# Altium schematic sheet [3] LORA MODULE.SchDoc: LLCC68 LoRa IC
size A3; CompanyName: RADWAG Wagi Elektroniczne; Organization: RADWAG Wagi Elektroniczne; Address1: ul. Bracka 28; Address2: 26-600 RADOM; Address3: POLAND; SheetNumber: 3; SheetTotal: 6
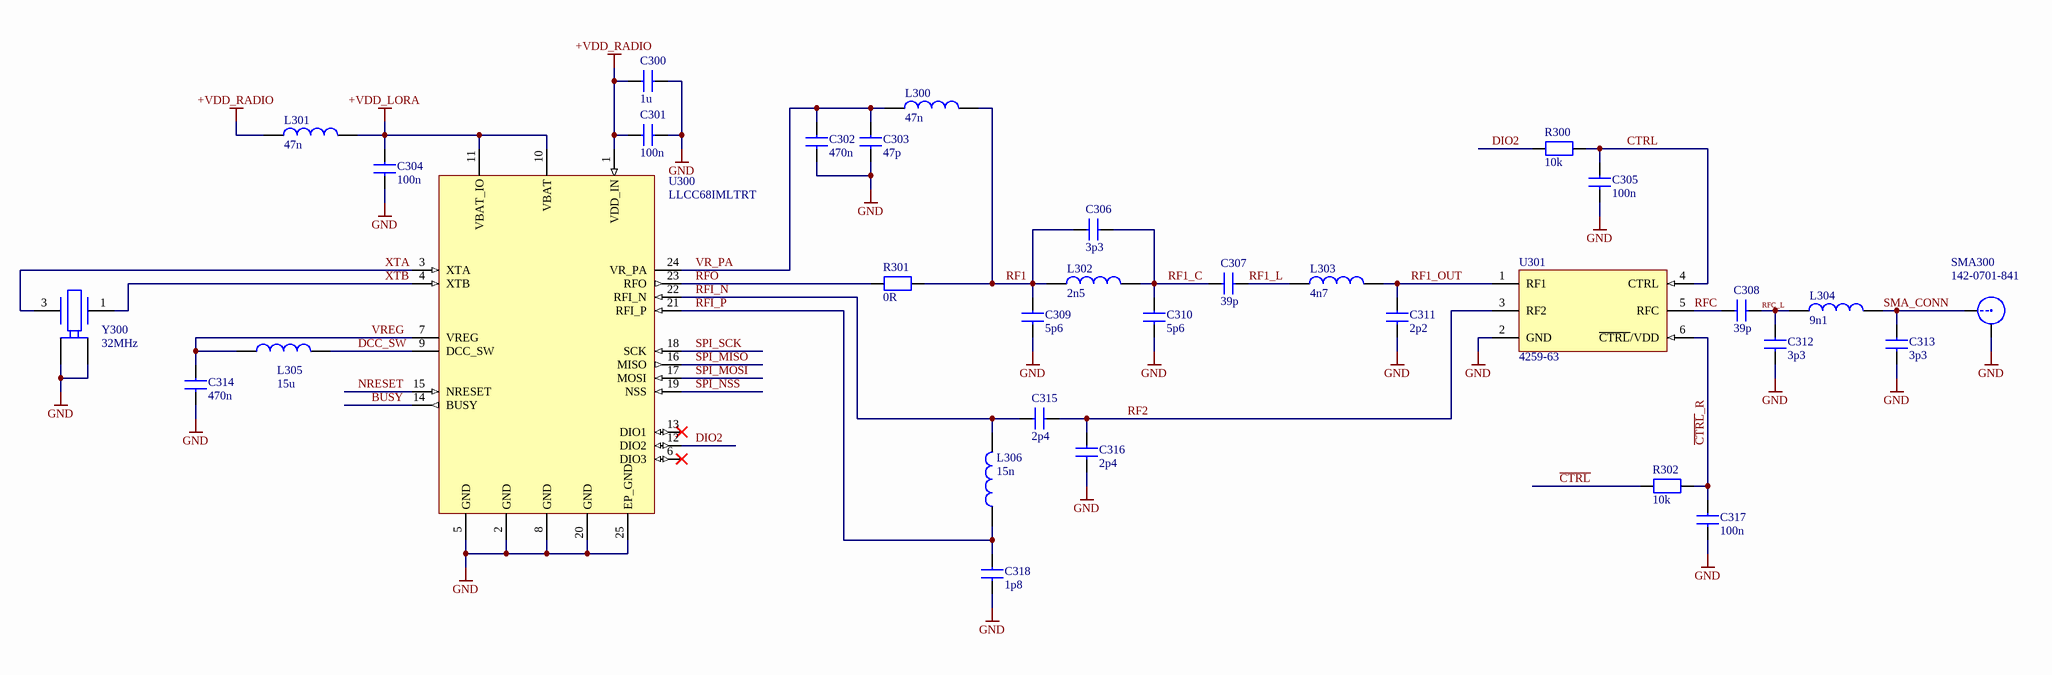
[diagram p0: [3] LORA MODULE.SchDoc]

## Parts
C300  1u  [C0402]
C301  100n  [C0402]
C302  470n  [C0402]
C303  47p  [C0402]
C304  100n  [C0402]
C305  100n  [C0402]
C306  3p3  [C0402]
C307  39p  [C0402]
C308  39p  [C0402]
C309  5p6  [C0402]
C310  5p6  [C0402]
C311  2p2  [C0402]
C312  3p3  [C0402]
C313  3p3  [C0402]
C314  470n  [C0402]
C315  2p4  [C0402]
C316  2p4  [C0402]
C317  100n  [C0402]
C318  1p8  [C0402]
L300  47n  [L0402]
L301  47n  [L0402]
L302  2n5  [l0402]
L303  4n7  [L0402]
L304  9n1  [L0402]
L305  15u  [L0805]
L306  15n  [L0402]
R300  10k  [R0402]
R301  0R  [R0402]
R302  10k  [R0402]
SMA300  142-0701-841  [SMA_STRAIGHT_CONN]
U300  LLCC68IMLTRT  [QFN24]
U301  4259-63  [SC70]
Y300  32MHz  [OSCILATOR_5X3_2]

## Nets
+VDD_LORA: C304.1 L301.2 U300.10(VBAT) U300.11(VBAT_IO)
+VDD_RADIO: C300.2 C301.2 L301.1 U300.1(VDD_IN)
GND: C300.1 C301.1 C302.1 C303.1 C304.2 C305.2 C309.1 C310.1 C311.1 C312.2 C313.2 C314.1 C316.2 C317.2 C318.1 SMA300.2 U300.2(GND) U300.5(GND) U300.8(GND) U300.20(GND) U300.25(EP_GND) U301.2(GND) Y300.2 Y300.4
~{CTRL}: R302.1
~{CTRL}_R: C317.1 R302.2 U301.6(~{CTRL}/VDD)
BUSY: U300.14(BUSY)
CTRL: C305.1 R300.2 U301.4(CTRL)
DCC_SW: L305.2 U300.9(DCC_SW)
DIO2: R300.1 U300.12(DIO2)
NRESET: U300.15(NRESET)
RF1: C306.2 C309.2 L300.2 L302.1 R301.2
RF1_C: C306.1 C307.2 C310.2 L302.2
RF1_L: C307.1 L303.1
RF1_OUT: C311.2 L303.2 U301.1(RF1)
RF2: C315.1 C316.1 U301.3(RF2)
RFC: C308.2 U301.5(RFC)
RFC_L: C308.1 C312.1 L304.1
RFI_N: C315.2 L306.2 U300.22(RFI_N)
RFI_P: C318.2 L306.1 U300.21(RFI_P)
RFO: R301.1 U300.23(RFO)
SMA_CONN: C313.1 L304.2 SMA300.1
SPI_MISO: U300.16(MISO)
SPI_MOSI: U300.17(MOSI)
SPI_NSS: U300.19(NSS)
SPI_SCK: U300.18(SCK)
VR_PA: C302.2 C303.2 L300.1 U300.24(VR_PA)
VREG: C314.2 L305.1 U300.7(VREG)
XTA: U300.3(XTA) Y300.3
XTB: U300.4(XTB) Y300.1

Not connected (* = marked no-connect by the designer): U300 6(DIO3)* 13(DIO1)*

## Notes on the sheet
- Title:
- Size: A3
- Page contents:
- Date:
- Version:
- Drawn by:
- Issue:
- Sheet number:
- of

## Library data of the parts
C300 = 0402X105K100CT: Multilayer Ceramic Capacitor, 1 uF, 10%, X5r, 10 V, 0402 [1005 Metric]; Manufacturer: Walsin Technologies; Supplier: Arrow Electronics; Supplier Part Number: 0402X105K100CT; Manufacturer Part Number: 0402X105K100CT; RoHS: Yes; Category: Ceramic Capacitors; Stock: 760000; Pricing: 10000=0,0037, 20000=0,0027, 50000=0,0026, 100000=0,0025, 250000=0,0023 (USD); ComponentLink1URL: http://www.farnell.com/datasheets/2340522.pdf?src-supplier=Farnell; ComponentLink1Description: http://www.farnell.com/datasheets/2340522.pdf?src-supplier=Farnell; ComponentLink2URL: http://www.farnell.com/datasheets/1958513.pdf?src-supplier=Farnell; ComponentLink2Description: http://www.farnell.com/datasheets/1958513.pdf?src-supplier=Farnell; ComponentLink3URL: http://www.farnell.com/datasheets/1958513.pdf?src-supplier=Element14; ComponentLink3Description: http://www.farnell.com/datasheets/1958513.pdf?src-supplier=Element14; ComponentLink4URL: https://datasheet.octopart.com/0402X105K100CT-Walsin-Technologies-datasheet-128065749.pdf?src-supplier=Future+Electronics; ComponentLink4Description: https://datasheet.octopart.com/0402X105K100CT-Walsin-Technologies-datasheet-128065749.pdf?src-supplier=Future+Electronics; ComponentLink5URL: https://datasheet.octopart.com/0402X105K100CT-Walsin-Technologies-datasheet-62066062.pdf?src-supplier=TME; ComponentLink5Description: https://datasheet.octopart.com/0402X105K100CT-Walsin-Technologies-datasheet-62066062.pdf?src-supplier=TME; ComponentLink6URL: https://datasheet.octopart.com/0402X105K100CT-Walsin-Technologies-datasheet-136037192.pdf?src-supplier=TECHDesign; ComponentLink6Description: https://datasheet.octopart.com/0402X105K100CT-Walsin-Technologies-datasheet-136037192.pdf?src-supplier=TECHDesign
C301 C304 C305 C317 = 04023C104KAT2A: Multilayer Ceramic Capacitor, 0.1 uF, 25 V, ± 10%, X7R, 0402 [1005 Metric]; Manufacturer: Kyocera AVX; Material: 4241ConductorMaterial; Value: 100nF; Voltage Rating: 25V; Supplier: Arrow Electronics; Supplier Part Number: 04023C104KAT2A; Manufacturer Part Number: 04023C104KAT2A; RoHS: Yes; Category: Ceramic Capacitors; Stock: 5700000; Pricing: 10000=0,0064, 20000=0,0061, 30000=0,0058, 50000=0,0052, 100000=0,0042, 150000=0,0038 (USD); Mounting Technology: Surface Mount; Case/Package: 0402; Pins: 2; Case Code (Metric): 1005; Case Code (Imperial): 0402; Min Operating Temperature: -55°C; Max Operating Temperature: 125°C; Tolerance: 10%; Dielectric: X7R; Packaging: Cut Tape; Voltage Rating (DC): 25V; Voltage: 25V; Series: -; Width: 1mm; Reach SVHC Compliant: No; Lead Free: Lead Free; RoHS Compliant: Yes; ComponentLink1URL: https://datasheet.ciiva.com/6265/cx7r-6265272.pdf?src-supplier=Digi-Key; ComponentLink1Description: https://datasheet.ciiva.com/6265/cx7r-6265272.pdf?src-supplier=Digi-Key; ComponentLink2URL: https://datasheet.ciiva.com/1123/1679506-1123344.pdf?src-supplier=Element14; ComponentLink2Description: https://datasheet.ciiva.com/1123/1679506-1123344.pdf?src-supplier=Element14; ComponentLink3URL: https://datasheet.ciiva.com/7709/1679506-7709527.pdf?src-supplier=Element14; ComponentLink3Description: https://datasheet.ciiva.com/7709/1679506-7709527.pdf?src-supplier=Element14; ComponentLink4URL: https://datasheet.ciiva.com/14906/cx7r-14906223.pdf?src-supplier=Digi-Key; ComponentLink4Description: https://datasheet.ciiva.com/14906/cx7r-14906223.pdf?src-supplier=Digi-Key; ComponentLink5URL: https://datasheet.ciiva.com/7614/cx7r-7614663.pdf?src-supplier=Digi-Key; ComponentLink5Description: https://datasheet.ciiva.com/7614/cx7r-7614663.pdf?src-supplier=Digi-Key
C302 C314 = GRM155R61A474ME15D: 0402 0.47 uF 10 V ±20% Tolerance X5R SMT Multilayer Ceramic Capacitor; Manufacturer: Murata; Supplier: Arrow Electronics; Supplier Part Number: GRM155R61A474ME15D; Manufacturer Part Number: GRM155R61A474ME15D; RoHS: Yes; Category: Ceramic Capacitors; Stock: 1003; Pricing: 1=0,0582, 10=0,0427, 25=0,0424, 100=0,0255, 250=0,0253, 500=0,025, 1000=0,0141 (USD); ComponentLink1URL: http://www.mouser.com/ds/2/281/c02e-2905.pdf?src-supplier=Mouser; ComponentLink1Description: http://www.mouser.com/ds/2/281/c02e-2905.pdf?src-supplier=Mouser; ComponentLink2URL: https://search.murata.co.jp/Ceramy/image/img/A01X/G101/ENG/GRM155R61A474ME15-01.pdf?src-supplier=Digi-Key; ComponentLink2Description: https://search.murata.co.jp/Ceramy/image/img/A01X/G101/ENG/GRM155R61A474ME15-01.pdf?src-supplier=Digi-Key
C303 = GRM1555C1H470JA01D: 0402 47 pF 50 V ±5% Tolerance C0G SMT Multilayer Ceramic Capacitor; Manufacturer: Murata; Value: 47pF; Voltage Rating: 50V; Supplier: Arrow Electronics; Supplier Part Number: GRM1555C1H470JA01D; Manufacturer Part Number: GRM1555C1H470JA01D; RoHS: Yes; Category: Ceramic Capacitors; Stock: 70000; Pricing: 10000=0,004 (USD); Mounting Technology: Surface Mount; Case/Package: 0402; Case Code (Metric): 1005; Case Code (Imperial): 0402; Material: Ceramic; Min Operating Temperature: -55°C; Max Operating Temperature: 125°C; Packaging: Tape and Reel; Package Quantity: 1; Voltage Rating (DC): 50V; Dielectric: C0G; Termination: SMD/SMT; Voltage: 50V; Series: GRM; Construction: Flat; Tolerance: 5%; Length: 1mm; Width: 0.02inch; Height: 0.5mm; Thickness: 0.022inch; Depth: 0.5mm; Radiation Hardening: No; Reach SVHC Compliant: No; Lead Free: Lead Free; RoHS Compliant: Yes; ComponentLink1URL: https://datasheet.ciiva.com/6271/grm1555c1h470ja01-01-6271072.pdf?src-supplier=Digi-Key; ComponentLink1Description: https://datasheet.ciiva.com/6271/grm1555c1h470ja01-01-6271072.pdf?src-supplier=Digi-Key; ComponentLink2URL: https://datasheet.ciiva.com/18184/getdatasheetpartid-301776-18184389.pdf?src-supplier=Verical; ComponentLink2Description: https://datasheet.ciiva.com/18184/getdatasheetpartid-301776-18184389.pdf?src-supplier=Verical; ComponentLink3URL: https://datasheet.ciiva.com/29199/453886-da-01-en-vs-kondensator-0402-29199975.pdf?src-supplier=Conrad; ComponentLink3Description: https://datasheet.ciiva.com/29199/453886-da-01-en-vs-kondensator-0402-29199975.pdf?src-supplier=Conrad; ComponentLink4URL: https://datasheet.ciiva.com/6271/partnumbering-e-01-6271070.pdf?src-supplier=Digi-Key; ComponentLink4Description: https://datasheet.ciiva.com/6271/partnumbering-e-01-6271070.pdf?src-supplier=Digi-Key; ComponentLink5URL: https://datasheet.ciiva.com/6271/partnumbering-e-01-6271077.pdf?src-supplier=Digi-Key; ComponentLink5Description: https://datasheet.ciiva.com/6271/partnumbering-e-01-6271077.pdf?src-supplier=Digi-Key; ComponentLink6URL: https://datasheet.ciiva.com/2989/product-2989327.pdf?src-supplier=Avnet; ComponentLink6Description: https://datasheet.ciiva.com/2989/product-2989327.pdf?src-supplier=Avnet; ComponentLink7URL: https://datasheet.ciiva.com/16390/product-16390970.pdf?src-supplier=Future+Electronics; ComponentLink7Description: https://datasheet.ciiva.com/16390/product-16390970.pdf?src-supplier=Future+Electronics; ComponentLink8URL: https://datasheet.ciiva.com/48671/product-48671327.pdf?src-supplier=Avnet; ComponentLink8Description: https://datasheet.ciiva.com/48671/product-48671327.pdf?src-supplier=Avnet
C306 C312 C313 = GRM1555C1H3R3BA01D: 0402 3.3 pF 50 V ±0.1 pF Tolerance C0G SMT Multilayer Ceramic Capacitor; Manufacturer: Murata; Supplier: Arrow Electronics; Supplier Part Number: GRM1555C1H3R3BA01D; Manufacturer Part Number: GRM1555C1H3R3BA01D; RoHS: Yes; Category: Ceramic Capacitors; Stock: 38428; Pricing: 1=0,056, 10=0,0157, 25=0,0153, 100=0,0095, 250=0,0094, 500=0,0089, 1000=0,0084, 3000=0,0078, 6000=0,0073, 15000=0,0068, 30000=0,0063 (USD); ComponentLink1URL: https://datasheet.ciiva.com/6270/grm1555c1h3r0wa01-01-6270835.pdf?src-supplier=Digi-Key; ComponentLink1Description: https://datasheet.ciiva.com/6270/grm1555c1h3r0wa01-01-6270835.pdf?src-supplier=Digi-Key; ComponentLink2URL: https://datasheet.ciiva.com/18184/getdatasheetpartid-318269-18184366.pdf?src-supplier=Verical; ComponentLink2Description: https://datasheet.ciiva.com/18184/getdatasheetpartid-318269-18184366.pdf?src-supplier=Verical; ComponentLink3URL: https://datasheet.ciiva.com/11614/product-11614449.pdf?src-supplier=Avnet; ComponentLink3Description: https://datasheet.ciiva.com/11614/product-11614449.pdf?src-supplier=Avnet; ComponentLink4URL: https://datasheet.ciiva.com/3779/grm1555c1h3r3ba0123-3779149.pdf?src-supplier=Arrow+Electronics; ComponentLink4Description: https://datasheet.ciiva.com/3779/grm1555c1h3r3ba0123-3779149.pdf?src-supplier=Arrow+Electronics; ComponentLink5URL: https://datasheet.ciiva.com/6270/partnumbering-e-01-6270837.pdf?src-supplier=Digi-Key; ComponentLink5Description: https://datasheet.ciiva.com/6270/partnumbering-e-01-6270837.pdf?src-supplier=Digi-Key; ComponentLink6URL: https://datasheet.ciiva.com/6270/partnumbering-e-01-6270839.pdf?src-supplier=Digi-Key; ComponentLink6Description: https://datasheet.ciiva.com/6270/partnumbering-e-01-6270839.pdf?src-supplier=Digi-Key
C307 C308 = GRM1555C1H390JA01D: Multilayer Ceramic Capacitor, 39 pF, 50 V, ± 5%, C0G (NP0), 0402 [1005 Metric]; Manufacturer: Murata; Supplier: Arrow Electronics; Supplier Part Number: GRM1555C1H390JA01D; Manufacturer Part Number: GRM1555C1H390JA01D; RoHS: Yes; Category: Ceramic Capacitors; Stock: 480000; Pricing: 10000=0,0042, 20000=0,0041, 30000=0,004, 50000=0,0039 (USD); ComponentLink1URL: https://datasheet.ciiva.com/11787/0900766b80ef921d-11787646.pdf?src-supplier=Rs; ComponentLink1Description: https://datasheet.ciiva.com/11787/0900766b80ef921d-11787646.pdf?src-supplier=Rs; ComponentLink2URL: https://datasheet.ciiva.com/18184/getdatasheetpartid-387778-18184346.pdf?src-supplier=Verical; ComponentLink2Description: https://datasheet.ciiva.com/18184/getdatasheetpartid-387778-18184346.pdf?src-supplier=Verical; ComponentLink3URL: https://datasheet.ciiva.com/29199/453824-da-01-en-vs-kondensator-0402-29199954.pdf?src-supplier=Conrad; ComponentLink3Description: https://datasheet.ciiva.com/29199/453824-da-01-en-vs-kondensator-0402-29199954.pdf?src-supplier=Conrad; ComponentLink4URL: https://datasheet.ciiva.com/7828/608985-7828862.pdf?src-supplier=Element14; ComponentLink4Description: https://datasheet.ciiva.com/7828/608985-7828862.pdf?src-supplier=Element14; ComponentLink5URL: https://datasheet.ciiva.com/6277/partnumbering-e-01-6277829.pdf?src-supplier=Digi-Key; ComponentLink5Description: https://datasheet.ciiva.com/6277/partnumbering-e-01-6277829.pdf?src-supplier=Digi-Key; ComponentLink6URL: https://datasheet.ciiva.com/6277/partnumbering-e-01-6277830.pdf?src-supplier=Digi-Key; ComponentLink6Description: https://datasheet.ciiva.com/6277/partnumbering-e-01-6277830.pdf?src-supplier=Digi-Key; ComponentLink7URL: https://datasheet.ciiva.com/6256/partnumbering-e-01-6256393.pdf?src-supplier=Digi-Key; ComponentLink7Description: https://datasheet.ciiva.com/6256/partnumbering-e-01-6256393.pdf?src-supplier=Digi-Key
C309 C310 = GRM1555C1H5R6CA01D: Multilayer Ceramic Capacitor, 5.6 pF, 50 V, ± 0.25pF, C0G (NP0), 0402 [1005 Metric]; Manufacturer: Murata; Supplier: Arrow Electronics; Supplier Part Number: GRM1555C1H5R6CA01D; Manufacturer Part Number: GRM1555C1H5R6CA01D; RoHS: Yes; Category: Ceramic Capacitors; Stock: 119940; Pricing: 10000=0,005, 20000=0,0047, 30000=0,0046, 50000=0,0041, 100000=0,0038 (USD); ComponentLink1URL: https://datasheet.ciiva.com/11789/0900766b80ef921d-11789216.pdf?src-supplier=Rs; ComponentLink1Description: https://datasheet.ciiva.com/11789/0900766b80ef921d-11789216.pdf?src-supplier=Rs; ComponentLink2URL: https://datasheet.ciiva.com/18184/getdatasheetpartid-387782-18184441.pdf?src-supplier=Verical; ComponentLink2Description: https://datasheet.ciiva.com/18184/getdatasheetpartid-387782-18184441.pdf?src-supplier=Verical; ComponentLink3URL: https://datasheet.ciiva.com/6263/grm1555c1h5r6ca01-01-6263746.pdf?src-supplier=Digi-Key; ComponentLink3Description: https://datasheet.ciiva.com/6263/grm1555c1h5r6ca01-01-6263746.pdf?src-supplier=Digi-Key; ComponentLink4URL: https://datasheet.ciiva.com/7828/608985-7828876.pdf?src-supplier=Element14; ComponentLink4Description: https://datasheet.ciiva.com/7828/608985-7828876.pdf?src-supplier=Element14; ComponentLink5URL: https://datasheet.ciiva.com/11612/product-11612261.pdf?src-supplier=Avnet; ComponentLink5Description: https://datasheet.ciiva.com/11612/product-11612261.pdf?src-supplier=Avnet
C311 = GRM1555C1H2R2BA01D: CAP CER 2.2PF 50V C0G/NP0 0402; Manufacturer: Murata; Supplier: Arrow Electronics; Supplier Part Number: GRM1555C1H2R2BA01D; Manufacturer Part Number: GRM1555C1H2R2BA01D; RoHS: Yes; Category: Ceramic Capacitors; Stock: 68227; Pricing: 10000=0,0061 (USD); ComponentLink1URL: https://datasheet.ciiva.com/18184/getdatasheetpartid-316203-18184296.pdf?src-supplier=Verical; ComponentLink1Description: https://datasheet.ciiva.com/18184/getdatasheetpartid-316203-18184296.pdf?src-supplier=Verical; ComponentLink2URL: https://datasheet.ciiva.com/6270/grm1555c1h2r1wa01-01-6270869.pdf?src-supplier=Digi-Key; ComponentLink2Description: https://datasheet.ciiva.com/6270/grm1555c1h2r1wa01-01-6270869.pdf?src-supplier=Digi-Key; ComponentLink3URL: https://datasheet.ciiva.com/16440/c02e-16440539.pdf?src-supplier=Future+Electronics; ComponentLink3Description: https://datasheet.ciiva.com/16440/c02e-16440539.pdf?src-supplier=Future+Electronics; ComponentLink4URL: https://datasheet.ciiva.com/6270/partnumbering-e-01-6270873.pdf?src-supplier=Digi-Key; ComponentLink4Description: https://datasheet.ciiva.com/6270/partnumbering-e-01-6270873.pdf?src-supplier=Digi-Key; ComponentLink5URL: https://datasheet.ciiva.com/6270/partnumbering-e-01-6270877.pdf?src-supplier=Digi-Key; ComponentLink5Description: https://datasheet.ciiva.com/6270/partnumbering-e-01-6270877.pdf?src-supplier=Digi-Key; ComponentLink6URL: https://datasheet.ciiva.com/11615/product-11615030.pdf?src-supplier=Avnet; ComponentLink6Description: https://datasheet.ciiva.com/11615/product-11615030.pdf?src-supplier=Avnet
C315 C316 = GRM1555C1H2R4BA01D: 0402 2.4 pF 50 V ±0.1 pF Tolerance C0G SMT Multilayer Ceramic Capacitor; Manufacturer: Murata; Supplier: Arrow Electronics; Supplier Part Number: GRM1555C1H2R4BA01D; Manufacturer Part Number: GRM1555C1H2R4BA01D; RoHS: Yes; Category: Ceramic Capacitors; Stock: 45185; Pricing: 1=0,054, 10=0,0273, 25=0,027, 50=0,0146, 100=0,0118, 250=0,0117, 500=0,0083, 1000=0,0078, 3000=0,0074, 6000=0,0069, 15000=0,0065, 30000=0,006 (USD); ComponentLink1URL: https://datasheet.ciiva.com/18184/getdatasheetpartid-317027-18184305.pdf?src-supplier=Verical; ComponentLink1Description: https://datasheet.ciiva.com/18184/getdatasheetpartid-317027-18184305.pdf?src-supplier=Verical; ComponentLink2URL: https://datasheet.ciiva.com/6270/grm1555c1h2r3wa01-01-6270881.pdf?src-supplier=Digi-Key; ComponentLink2Description: https://datasheet.ciiva.com/6270/grm1555c1h2r3wa01-01-6270881.pdf?src-supplier=Digi-Key; ComponentLink3URL: https://datasheet.ciiva.com/11614/product-11614783.pdf?src-supplier=Avnet; ComponentLink3Description: https://datasheet.ciiva.com/11614/product-11614783.pdf?src-supplier=Avnet; ComponentLink4URL: https://datasheet.ciiva.com/6270/partnumbering-e-01-6270885.pdf?src-supplier=Digi-Key; ComponentLink4Description: https://datasheet.ciiva.com/6270/partnumbering-e-01-6270885.pdf?src-supplier=Digi-Key; ComponentLink5URL: https://datasheet.ciiva.com/6270/partnumbering-e-01-6270891.pdf?src-supplier=Digi-Key; ComponentLink5Description: https://datasheet.ciiva.com/6270/partnumbering-e-01-6270891.pdf?src-supplier=Digi-Key
C318 = GRM1555C1H1R8BA01D: Multilayer Ceramic Capacitor, 1.8 pF, 50 V, ± 0.1pF, C0G (NP0), 0402 [1005 Metric]; Manufacturer: Murata; Supplier: Arrow Electronics; Supplier Part Number: GRM1555C1H1R8BA01D; Manufacturer Part Number: GRM1555C1H1R8BA01D; RoHS: Yes; Category: Ceramic Capacitors; Stock: 43235; Pricing: 1=0,0502, 10=0,028, 25=0,0221, 100=0,0164, 250=0,016, 500=0,0142, 1000=0,0099, 3000=0,0096, 6000=0,0082, 15000=0,008, 30000=0,007 (USD); ComponentLink1URL: https://datasheet.ciiva.com/18184/getdatasheetpartid-318417-18184249.pdf?src-supplier=Verical; ComponentLink1Description: https://datasheet.ciiva.com/18184/getdatasheetpartid-318417-18184249.pdf?src-supplier=Verical; ComponentLink2URL: https://datasheet.ciiva.com/5412/product-5412504.pdf?src-supplier=Mouser; ComponentLink2Description: https://datasheet.ciiva.com/5412/product-5412504.pdf?src-supplier=Mouser; ComponentLink3URL: https://datasheet.ciiva.com/6270/grm1555c1h1r8ba01-01-6270918.pdf?src-supplier=Digi-Key; ComponentLink3Description: https://datasheet.ciiva.com/6270/grm1555c1h1r8ba01-01-6270918.pdf?src-supplier=Digi-Key; ComponentLink4URL: https://datasheet.ciiva.com/6270/partnumbering-e-01-6270920.pdf?src-supplier=Digi-Key; ComponentLink4Description: https://datasheet.ciiva.com/6270/partnumbering-e-01-6270920.pdf?src-supplier=Digi-Key; ComponentLink5URL: https://datasheet.ciiva.com/6270/partnumbering-e-01-6270922.pdf?src-supplier=Digi-Key; ComponentLink5Description: https://datasheet.ciiva.com/6270/partnumbering-e-01-6270922.pdf?src-supplier=Digi-Key
L300 L301 = LQW15AN47NJ00D: Inductor RF Chip Wirewound 47nH 5% 100MHz 25Q-Factor 210mA 1.08Ohm DCR 0402 Paper T/R; Manufacturer: Murata; Supplier: Arrow Electronics; Supplier Part Number: LQW15AN47NJ00D; Manufacturer Part Number: LQW15AN47NJ00D; RoHS: Yes; Category: Fixed Inductors; Stock: 5244; Pricing: 1=0,1203, 10=0,091, 25=0,0848, 100=0,072, 250=0,0719, 500=0,0712, 1000=0,0515, 3000=0,051 (USD); ComponentLink1URL: https://datasheet.ciiva.com/11799/0900766b8090d800-11799049.pdf?src-supplier=Rs; ComponentLink1Description: https://datasheet.ciiva.com/11799/0900766b8090d800-11799049.pdf?src-supplier=Rs; ComponentLink2URL: https://datasheet.ciiva.com/1042/l0075s0080lqw15a-00-1042160.pdf?src-supplier=Digi-Key; ComponentLink2Description: https://datasheet.ciiva.com/1042/l0075s0080lqw15a-00-1042160.pdf?src-supplier=Digi-Key; ComponentLink3URL: https://datasheet.ciiva.com/1042/l0075s0080lqw15a-00-1042159.pdf?src-supplier=Digi-Key; ComponentLink3Description: https://datasheet.ciiva.com/1042/l0075s0080lqw15a-00-1042159.pdf?src-supplier=Digi-Key; ComponentLink4URL: https://datasheet.ciiva.com/1042/l0075s0080lqw15a-00-1042161.pdf?src-supplier=Digi-Key; ComponentLink4Description: https://datasheet.ciiva.com/1042/l0075s0080lqw15a-00-1042161.pdf?src-supplier=Digi-Key; ComponentLink5URL: https://datasheet.ciiva.com/8506/l0075s0080lqw15a-00-8506009.pdf?src-supplier=Avnet; ComponentLink5Description: https://datasheet.ciiva.com/8506/l0075s0080lqw15a-00-8506009.pdf?src-supplier=Avnet
L302 = LQW15AN2N5C00D: Inductor RF Chip Wirewound 2.5nH 0.2nH 100MHz 20Q-Factor 850mA 50mOhm DCR 0402 Paper T/R; Manufacturer: Murata; Supplier: Arrow Electronics; Supplier Part Number: LQW15AN2N5C00D; Manufacturer Part Number: LQW15AN2N5C00D; RoHS: Yes; Category: Fixed Inductors; Stock: 2732; Pricing: 1=0,1213, 10=0,0957, 25=0,0871, 100=0,075, 250=0,0699, 500=0,0692, 1000=0,0504 (USD); ComponentLink1URL: https://datasheet.ciiva.com/8507/l0075s0080lqw15a-00-8507644.pdf?src-supplier=Avnet; ComponentLink1Description: https://datasheet.ciiva.com/8507/l0075s0080lqw15a-00-8507644.pdf?src-supplier=Avnet; ComponentLink2URL: https://datasheet.ciiva.com/4977/product-4977756.pdf?src-supplier=Mouser; ComponentLink2Description: https://datasheet.ciiva.com/4977/product-4977756.pdf?src-supplier=Mouser; ComponentLink3URL: https://datasheet.ciiva.com/6705/l0075s0080lqw15a-00-6705365.pdf?src-supplier=Digi-Key; ComponentLink3Description: https://datasheet.ciiva.com/6705/l0075s0080lqw15a-00-6705365.pdf?src-supplier=Digi-Key; ComponentLink4URL: https://datasheet.ciiva.com/6705/l0075s0080lqw15a-00-6705366.pdf?src-supplier=Digi-Key; ComponentLink4Description: https://datasheet.ciiva.com/6705/l0075s0080lqw15a-00-6705366.pdf?src-supplier=Digi-Key
L303 = LQW15AN4N7C00D: Inductor RF Chip Wirewound 4.7nH 0.2nH 100MHz 25Q-Factor 750mA 70mOhm DCR 0402 Paper T/R; Manufacturer: Murata; Core Material: Air,Non-Magnetic,Ferrite; DC Resistance (DCR): 70mR; Shielding: Unshielded; Q Factor: 25; Self Resonant Frequency: 8GHz; Supplier: Arrow Electronics; Supplier Part Number: LQW15AN4N7C00D; Manufacturer Part Number: LQW15AN4N7C00D; RoHS: Yes; Category: Fixed Inductors; Stock: 1773; Pricing: 1=0,1213, 10=0,0914, 25=0,0893, 100=0,0773, 250=0,077, 500=0,0723, 1000=0,0541 (USD); Mounting Technology: Surface Mount; Case/Package: 0402; Pins: 2; Weight: 2.8E-05oz; Case Code (Metric): 1005; Case Code (Imperial): 0402; Min Operating Temperature: -55°C; Max Operating Temperature: 125°C; Value: 4.7nH; Max DC Current: 750mA; Packaging: Tape and Reel; Package Quantity: 1; Current Rating: 750mA; Test Frequency: 100MHz; Termination: SMD/SMT; DC Current: 750mA; Series: LQW15A_00; Max Current Rating: 750mA; Length: 1mm; Width: 0.02inch; Height: 0.5mm; Depth: 0.7mm; Radiation Hardening: No; Reach SVHC Compliant: No; Military Standard: Not; Lead Free: Lead Free; RoHS Compliant: Yes; ComponentLink1URL: https://datasheet.ciiva.com/11799/0900766b8090d800-11799023.pdf?src-supplier=Rs; ComponentLink1Description: https://datasheet.ciiva.com/11799/0900766b8090d800-11799023.pdf?src-supplier=Rs; ComponentLink2URL: https://datasheet.ciiva.com/6690/l0075s0080lqw15a-00-6690821.pdf?src-supplier=Digi-Key; ComponentLink2Description: https://datasheet.ciiva.com/6690/l0075s0080lqw15a-00-6690821.pdf?src-supplier=Digi-Key; ComponentLink3URL: https://datasheet.ciiva.com/8507/l0075s0080lqw15a-00-8507561.pdf?src-supplier=Avnet; ComponentLink3Description: https://datasheet.ciiva.com/8507/l0075s0080lqw15a-00-8507561.pdf?src-supplier=Avnet; ComponentLink4URL: https://datasheet.ciiva.com/18089/getdatasheetpartid-153206-18089707.pdf?src-supplier=Verical; ComponentLink4Description: https://datasheet.ciiva.com/18089/getdatasheetpartid-153206-18089707.pdf?src-supplier=Verical
L304 = LQW15AN9N1H00D: Inductor RF Chip Wirewound 9.1nH 3% 100MHz 25Q-Factor 540mA 140mOhm DCR 0402 Paper T/R; Manufacturer: Murata; Core Material: Non-Magnetic,Air,Ferrite; Shielding: Unshielded; Q Factor: 25; DC Resistance (DCR): 140mR; Self Resonant Frequency: 5.5GHz; Supplier: Arrow Electronics; Supplier Part Number: LQW15AN9N1H00D; Manufacturer Part Number: LQW15AN9N1H00D; RoHS: Yes; Category: Fixed Inductors; Stock: 11686; Pricing: 1=0,1288, 10=0,1003, 25=0,0878, 100=0,0788, 250=0,0732, 500=0,0688, 1000=0,0498, 3000=0,0496, 6000=0,0404 (USD); Mounting Technology: Surface Mount; Case/Package: 0402; Weight: 2.8E-05oz; Case Code (Metric): 1005; Case Code (Imperial): 0402; Min Operating Temperature: -55°C; Max Operating Temperature: 125°C; Package Quantity: 1; Packaging: Tape and Reel; Tolerance: 3%; Current Rating: 540mA; Value: 9.1nH; Test Frequency: 100MHz; Max DC Current: 540mA; Termination: SMD/SMT; DC Current: 540mA; Series: LQW15A_00; Length: 1mm; Width: 0.02inch; Height: 0.5mm; Height - Seated (Max): 0.024inch; Depth: 0.7mm; Radiation Hardening: No; Military Standard: Not; Lead Free: Lead Free; RoHS Compliant: Yes; ComponentLink1URL: https://datasheet.ciiva.com/11799/0900766b8090d800-11799112.pdf?src-supplier=Rs; ComponentLink1Description: https://datasheet.ciiva.com/11799/0900766b8090d800-11799112.pdf?src-supplier=Rs; ComponentLink2URL: https://datasheet.ciiva.com/4980/product-4980661.pdf?src-supplier=Mouser; ComponentLink2Description: https://datasheet.ciiva.com/4980/product-4980661.pdf?src-supplier=Mouser; ComponentLink3URL: https://datasheet.ciiva.com/29697/l0075s0080lqw15a-00-29697038.pdf?src-supplier=Digi-Key; ComponentLink3Description: https://datasheet.ciiva.com/29697/l0075s0080lqw15a-00-29697038.pdf?src-supplier=Digi-Key; ComponentLink4URL: https://datasheet.ciiva.com/29697/l0075s0080lqw15a-00-29697039.pdf?src-supplier=Digi-Key; ComponentLink4Description: https://datasheet.ciiva.com/29697/l0075s0080lqw15a-00-29697039.pdf?src-supplier=Digi-Key; ComponentLink5URL: https://datasheet.ciiva.com/8507/l0075s0080lqw15a-00-8507397.pdf?src-supplier=Avnet; ComponentLink5Description: https://datasheet.ciiva.com/8507/l0075s0080lqw15a-00-8507397.pdf?src-supplier=Avnet
L305 = MLZ2012M150WT000: Inductor Power Shielded Multi-Layer 15uH 20% 2MHz Ferrite 0.25A 1.235Ohm DCR 0805 T/R; Manufacturer: TDK; Self Resonant Frequency: 40MHz; Saturation Current: 120mA; DC Resistance (DCR): 950mR; Supplier: Arrow Electronics; Supplier Part Number: MLZ2012M150WT000; Manufacturer Part Number: MLZ2012M150WT000; RoHS: Yes; Category: Fixed Inductors; Stock: 2000; Pricing: 2000=0,039, 10000=0,037, 24000=0,036, 50000=0,035, 100000=0,034 (USD); Mounting Technology: Surface Mount; Case/Package: 0805; Case Code (Metric): 2012; Case Code (Imperial): 0805; Core Material: Ferrite; Min Operating Temperature: -55°C; Max Operating Temperature: 125°C; Packaging: Cut Tape; Value: 15uH; Tolerance: 20%; Shielding: Shielded; Test Frequency: 2MHz; Series: MLZ; RoHS Compliant: Yes; ComponentLink1URL: https://datasheet.ciiva.com/29690/inductor-commercial-decoupling-mlz-en-29690328.pdf?src-supplier=Digi-Key; ComponentLink1Description: https://datasheet.ciiva.com/29690/inductor-commercial-decoupling-mlz-en-29690328.pdf?src-supplier=Digi-Key; ComponentLink2URL: https://datasheet.ciiva.com/29690/inductor-commercial-decoupling-mlz-en-29690327.pdf?src-supplier=Digi-Key; ComponentLink2Description: https://datasheet.ciiva.com/29690/inductor-commercial-decoupling-mlz-en-29690327.pdf?src-supplier=Digi-Key; ComponentLink3URL: https://datasheet.ciiva.com/29690/inductor-commercial-decoupling-mlz-en-29690329.pdf?src-supplier=Digi-Key; ComponentLink3Description: https://datasheet.ciiva.com/29690/inductor-commercial-decoupling-mlz-en-29690329.pdf?src-supplier=Digi-Key
L306 = LQW15AN15NH00D: Inductor RF Chip Wirewound 15nH 3% 100MHz 30Q-Factor 460mA 160mOhm DCR 0402 Paper T/R; Manufacturer: Murata; Supplier: Arrow Electronics; Supplier Part Number: LQW15AN15NH00D; Manufacturer Part Number: LQW15AN15NH00D; RoHS: Yes; Category: Fixed Inductors; Stock: 11749; Pricing: 1=0,1274, 10=0,0874, 25=0,0864, 100=0,0683, 250=0,0676, 500=0,0669, 1000=0,0491, 3000=0,0486, 6000=0,0411 (USD); ComponentLink1URL: https://datasheet.ciiva.com/11799/0900766b8090d800-11799017.pdf?src-supplier=Rs; ComponentLink1Description: https://datasheet.ciiva.com/11799/0900766b8090d800-11799017.pdf?src-supplier=Rs; ComponentLink2URL: https://datasheet.ciiva.com/8507/l0075s0080lqw15a-00-8507493.pdf?src-supplier=Avnet; ComponentLink2Description: https://datasheet.ciiva.com/8507/l0075s0080lqw15a-00-8507493.pdf?src-supplier=Avnet; ComponentLink3URL: https://datasheet.ciiva.com/18089/getdatasheetpartid-136002-18089494.pdf?src-supplier=Verical; ComponentLink3Description: https://datasheet.ciiva.com/18089/getdatasheetpartid-136002-18089494.pdf?src-supplier=Verical; ComponentLink4URL: https://datasheet.ciiva.com/6705/l0075s0080lqw15a-00-6705423.pdf?src-supplier=Digi-Key; ComponentLink4Description: https://datasheet.ciiva.com/6705/l0075s0080lqw15a-00-6705423.pdf?src-supplier=Digi-Key
R300 R302 = 0402WGF1002TCE: Res Thick Film 0402 10K Ohm 1% 0.063W(1/16W) ±100ppm/°C Pad SMD T/R; Manufacturer: Royal Electronic Factory; Supplier: Mouser; Supplier Part Number: 303-0402WGF1002TCE; Manufacturer Part Number: 0402WGF1002TCE; RoHS: Yes; Stock: 1290000; Pricing: 10000=0,001 (USD); ComponentLink1URL: https://datasheet.octopart.com/0402WGF1002TCE-Royal-Ohm-datasheet-165785611.pdf?src-supplier=TME; ComponentLink1Description: https://datasheet.octopart.com/0402WGF1002TCE-Royal-Ohm-datasheet-165785611.pdf?src-supplier=TME
R301 = CRCW04020000Z0ED: CRCW Series 0402 0.063 W 0 Ohm Jumper Surface Mount Thick Film Chip Resistor; Manufacturer: Vishay; Value: 0mR; Voltage Rating: 50V; Max Power Dissipation: 63mW; Temperature Coefficient: 100ppm/°C; Tolerance: 5%; Supplier: Mouser; Supplier Part Number: 71-CRCW0402-0-E3; Manufacturer Part Number: CRCW04020000Z0ED; RoHS: Yes; Category: Chip SMD Resistors; Stock: 3384311; Pricing: 1=0,1, 10=0,017, 50=0,017, 100=0,008, 1000=0,006, 10000=0,004 (USD); Case/Package: 0402; Case Code (Imperial): 0402; Case Code (Metric): 1005; Contact Plating: Tin; Weight: 2.3E-05oz; Min Operating Temperature: -55°C; Max Operating Temperature: 155°C; Packaging: Tape and Reel; Number of Terminations: 2; Series: CRCW; Package Quantity: 10000; Power Rating: 63mW; Resistor Type: Thick Film; Termination: SMD/SMT; Features: Automotive AEC-Q200; Voltage Rating (DC): 50V; Construction: Rectangular; Length: 1mm; Width: 0.5mm; Height: 0.35mm; Depth: 0.5mm; Ratings: AEC-Q200; Radiation Hardening: No; Lead Free: Lead Free; RoHS Compliant: Yes; Reach SVHC Compliant: Unknown; Military Standard: Not; ComponentLink1URL: https://datasheet.ciiva.com/7841/1720486-7841802.pdf?src-supplier=Element14; ComponentLink1Description: https://datasheet.ciiva.com/7841/1720486-7841802.pdf?src-supplier=Element14; ComponentLink2URL: https://datasheet.ciiva.com/26311/fld-crcw-e3-data-en-26311550.pdf?src-supplier=Distrelec; ComponentLink2Description: https://datasheet.ciiva.com/26311/fld-crcw-e3-data-en-26311550.pdf?src-supplier=Distrelec; ComponentLink3URL: https://datasheet.ciiva.com/7841/1697337-7841468.pdf?src-supplier=Element14; ComponentLink3Description: https://datasheet.ciiva.com/7841/1697337-7841468.pdf?src-supplier=Element14; ComponentLink4URL: https://datasheet.ciiva.com/2461/dcrcwe3-2461963.pdf?src-supplier=Digi-Key; ComponentLink4Description: https://datasheet.ciiva.com/2461/dcrcwe3-2461963.pdf?src-supplier=Digi-Key; ComponentLink5URL: https://datasheet.ciiva.com/2461/dcrcwe3-2461964.pdf?src-supplier=Digi-Key; ComponentLink5Description: https://datasheet.ciiva.com/2461/dcrcwe3-2461964.pdf?src-supplier=Digi-Key; ComponentLink6URL: https://datasheet.ciiva.com/2461/dcrcwe3-2461962.pdf?src-supplier=Digi-Key; ComponentLink6Description: https://datasheet.ciiva.com/2461/dcrcwe3-2461962.pdf?src-supplier=Digi-Key; ComponentLink7URL: https://datasheet.ciiva.com/16761/70200976-16761309.pdf?src-supplier=Allied+Electronics; ComponentLink7Description: https://datasheet.ciiva.com/16761/70200976-16761309.pdf?src-supplier=Allied+Electronics; ComponentLink8URL: https://datasheet.ciiva.com/3255/dcrcwe3-3255944.pdf?src-supplier=Avnet; ComponentLink8Description: https://datasheet.ciiva.com/3255/dcrcwe3-3255944.pdf?src-supplier=Avnet
SMA300 = 142-0701-841: Conn SMA RCP 0Hz to 18GHz 50Ohm Solder ST Edge Mount Gold; Manufacturer: Bel Cinch; Body Material: Brass; Gender: Female; Impedance: 50R; Connector Type: PCB,SMA,Coaxial; Voltage Rating: 335V; Operating Frequency: 0 to 18 GHz; Contact Resistance: 3mR; Mating Cycles: 500; Insulation Resistance: 5GR; Panel Thickness: 1.07mm; Supplier: Avnet; Supplier Part Number: 142-0701-841; Manufacturer Part Number: 142-0701-841; RoHS: Yes; Category: RF / Coaxial Connectors; Stock: 2000; Pricing: 25=6,0225 (USD); Mounting Technology: Edge,Board,Through Hole,PCB; Case/Package: SMA; Contact Plating: Gold; Contact Material: Copper,Brass; Body Plating: Gold; Color: Gold; Insulation Material: Teflon; Housing Material: Brass; Min Operating Temperature: -65°C; Max Operating Temperature: 165°C; Termination: Solder; Orientation: Straight; Package Quantity: 25; Packaging: Bulk; Clock Frequency: 18GHz; Series: SMA; Frequency: 18GHz; Working Voltage: 335V; Length: 0.44inch; Radiation Hardening: No; Reach SVHC Compliant: No; Lead Free: Lead Free; RoHS Compliant: Yes
U300 = LLCC68IMLTRT: RF Transceiver LoRa Smart Home low pwr 150-960MHz ISM; Manufacturer Part Number: LLCC68IMLTRT
U301 = 4259-63: RF Switch, SPDT, 0.01 to 3 GHz, 0.35 to 0.45 dB IL, 29 to 30 dB Isolation, 34 dBm Pwr Rating, SC-70; Manufacturer: Peregrine Semiconductor; Impedance: 50R; P1dB: 29dBm; IIP3: 55dBm; Supplier: Arrow Electronics; Supplier Part Number: 4259-63; Manufacturer Part Number: 4259-63; RoHS: Yes; Category: Uncategorized; Pins: 6; Min Operating Temperature: -40°C; Max Operating Temperature: 85°C; Packaging: Tape and Reel; Package Quantity: 1; Throw Configuration: SPDT
Y300 = LFXTAL059535BULK: Rezonator: kwarcowy; 32MHz; ±20ppm; 18pF; SMD; 5x3,2x1mm; Manufacturer Part Number: LFXTAL059535BULK